# Altium schematic sheet MUX_EEM_EXT.SchDoc
size 420 x 297 mm; DocumentNumber: 7; SheetNumber: 7; SheetTotal: 8; EDA_Number: ARTIQ; ModifiedBy: -; Title2: -; DivGrp: ISE; ModifiedDate: -
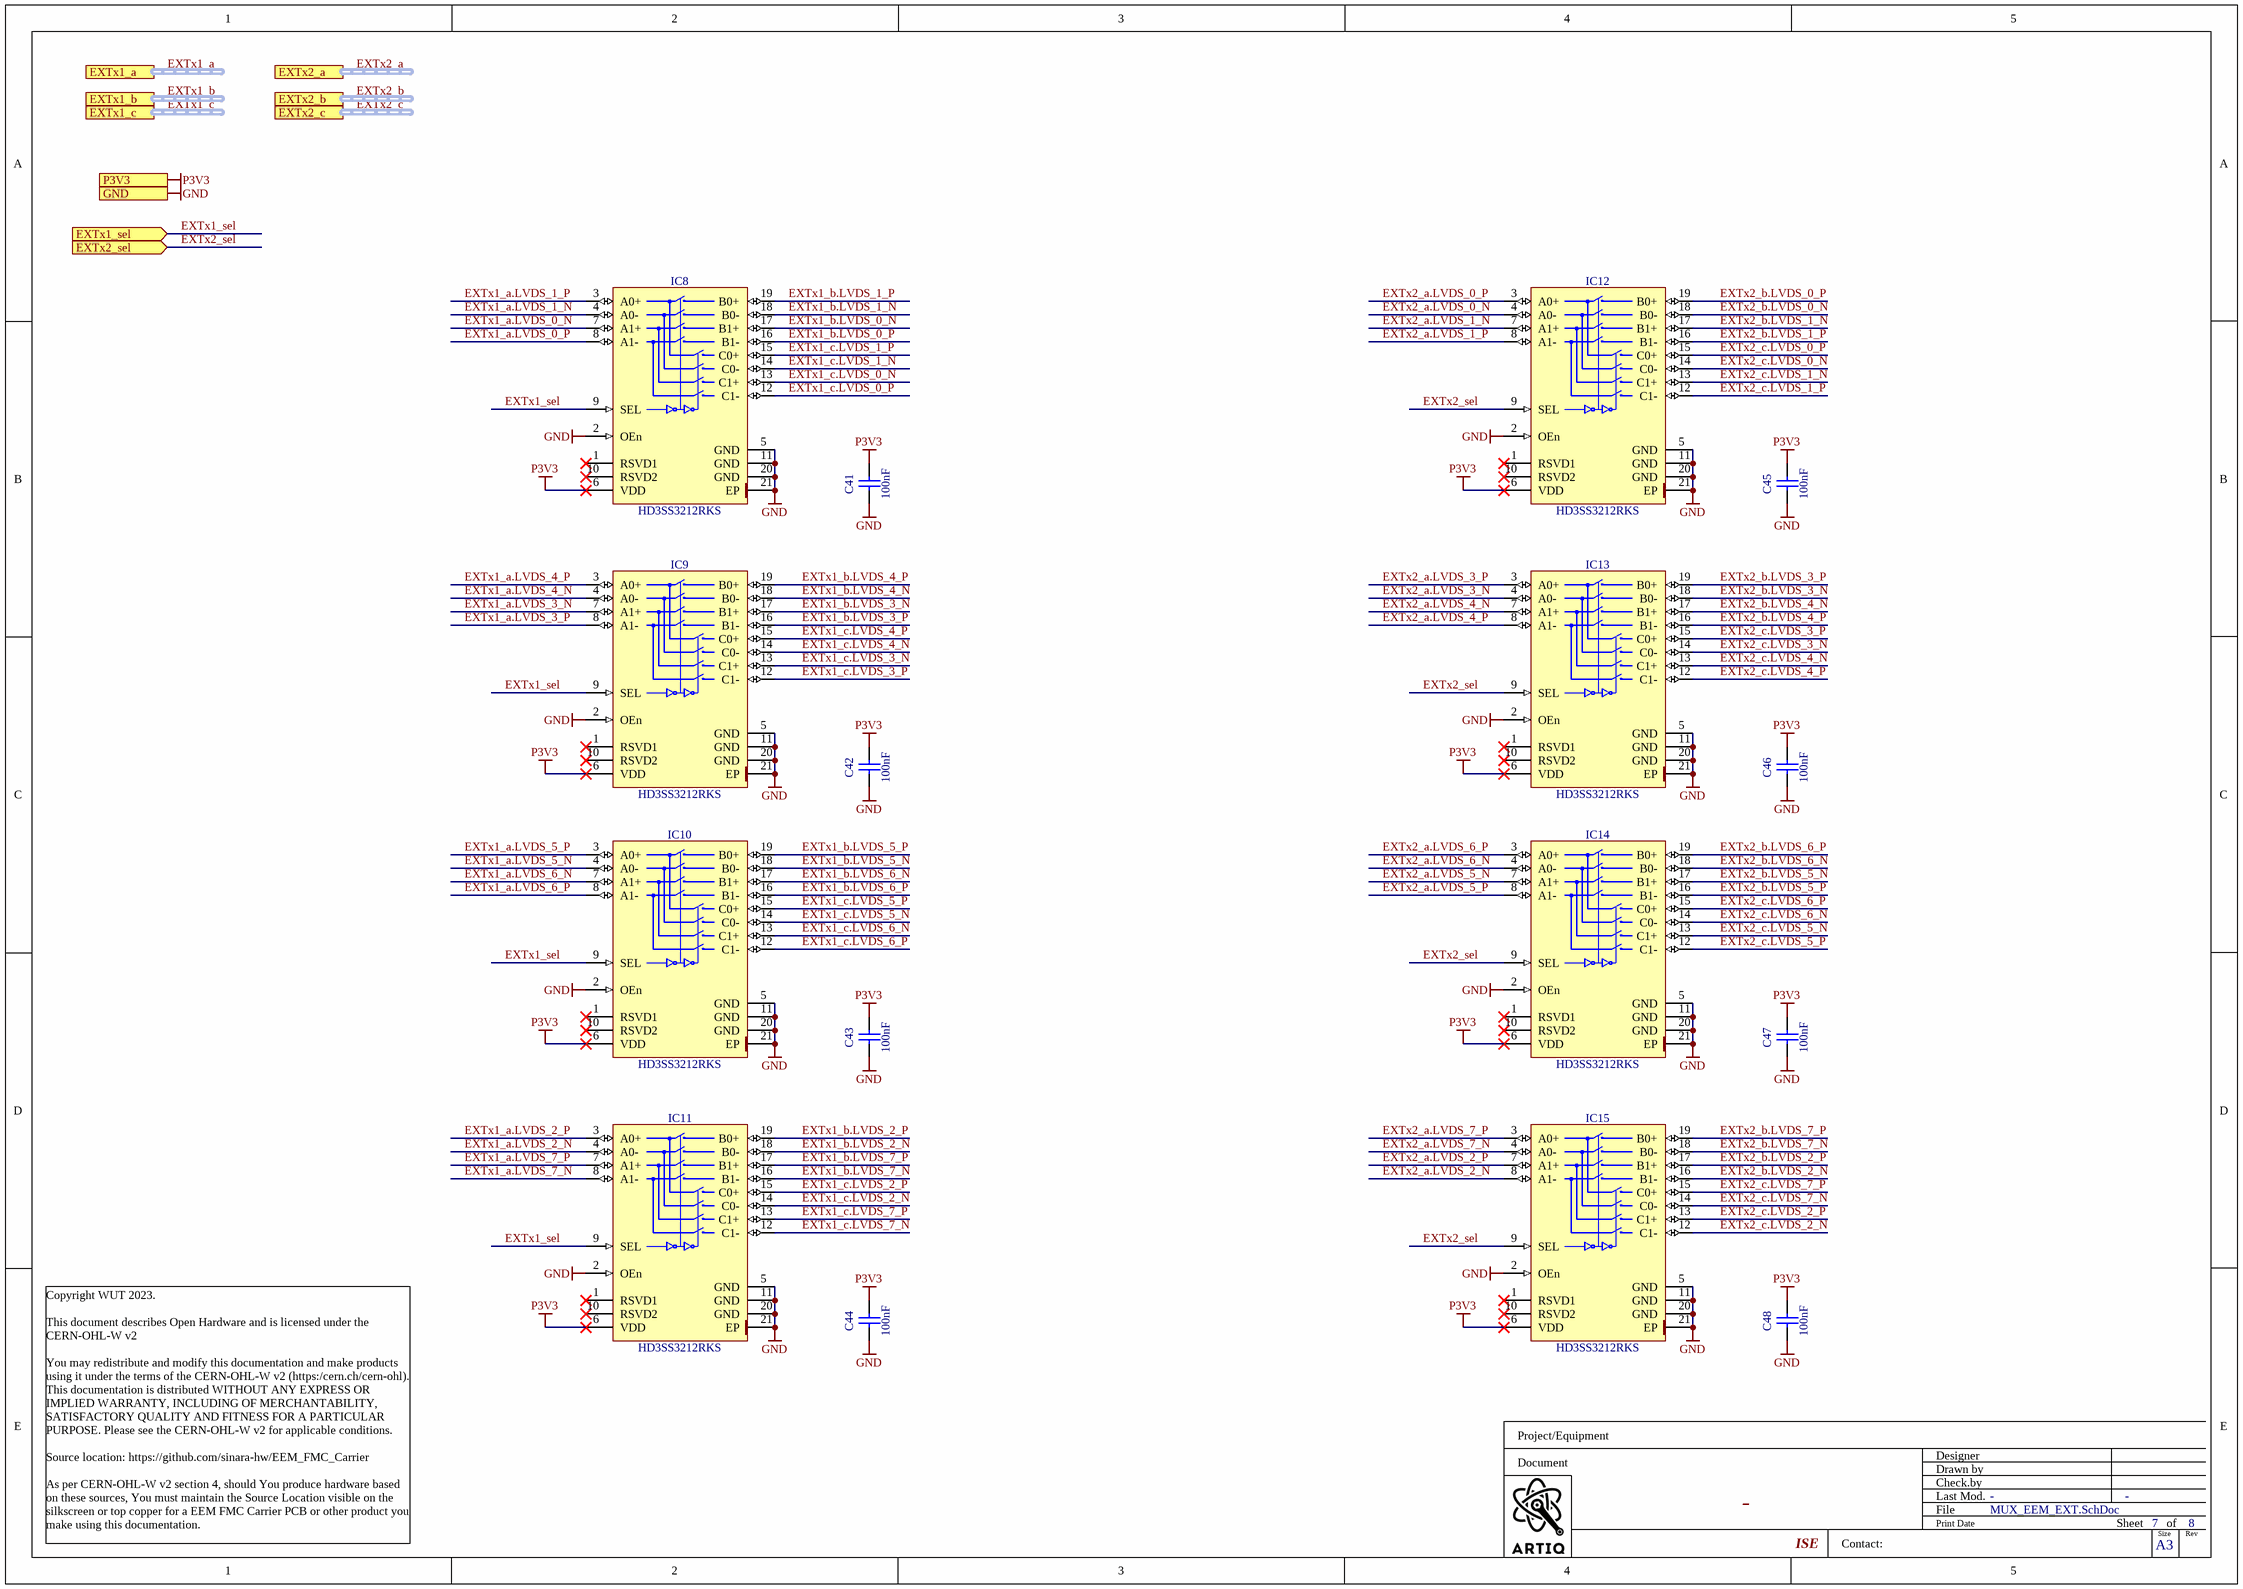
[diagram p0: MUX_EEM_EXT.SchDoc]

## Parts
C41  100nF  [CAPC1005X55N]
C42  100nF  [CAPC1005X55N]
C43  100nF  [CAPC1005X55N]
C44  100nF  [CAPC1005X55N]
C45  100nF  [CAPC1005X55N]
C46  100nF  [CAPC1005X55N]
C47  100nF  [CAPC1005X55N]
C48  100nF  [CAPC1005X55N]
IC8  HD3SS3212RKS  [TEXAS_RKS0020A]
IC9  HD3SS3212RKS  [TEXAS_RKS0020A]
IC10  HD3SS3212RKS  [TEXAS_RKS0020A]
IC11  HD3SS3212RKS  [TEXAS_RKS0020A]
IC12  HD3SS3212RKS  [TEXAS_RKS0020A]
IC13  HD3SS3212RKS  [TEXAS_RKS0020A]
IC14  HD3SS3212RKS  [TEXAS_RKS0020A]
IC15  HD3SS3212RKS  [TEXAS_RKS0020A]

## Ports
EXTx1_a (harness ExtensionConnector), EXTx1_b (harness ExtensionConnector), EXTx1_c (harness ExtensionConnector), EXTx1_sel (in), EXTx2_a (harness ExtensionConnector), EXTx2_b (harness ExtensionConnector), EXTx2_c (harness ExtensionConnector), EXTx2_sel (in), GND, P3V3 (in)

## Nets
GND: C41.1 C42.1 C43.1 C44.1 C45.1 C46.1 C47.1 C48.1 IC8.2(OEn) IC8.5(GND) IC8.11(GND) IC8.20(GND) IC8.21(EP) IC9.2(OEn) IC9.5(GND) IC9.11(GND) IC9.20(GND) IC9.21(EP) IC10.2(OEn) IC10.5(GND) IC10.11(GND) IC10.20(GND) IC10.21(EP) IC11.2(OEn) IC11.5(GND) IC11.11(GND) IC11.20(GND) IC11.21(EP) IC12.2(OEn) IC12.5(GND) IC12.11(GND) IC12.20(GND) IC12.21(EP) IC13.2(OEn) IC13.5(GND) IC13.11(GND) IC13.20(GND) IC13.21(EP) IC14.2(OEn) IC14.5(GND) IC14.11(GND) IC14.20(GND) IC14.21(EP) IC15.2(OEn) IC15.5(GND) IC15.11(GND) IC15.20(GND) IC15.21(EP) ; port GND
P3V3: C41.2 C42.2 C43.2 C44.2 C45.2 C46.2 C47.2 C48.2 IC8.6(VDD) IC9.6(VDD) IC10.6(VDD) IC11.6(VDD) IC12.6(VDD) IC13.6(VDD) IC14.6(VDD) IC15.6(VDD) ; port P3V3
EXTx1_a.LVDS_0_N: IC8.7(A1+)
EXTx1_a.LVDS_0_P: IC8.8(A1-)
EXTx1_a.LVDS_1_N: IC8.4(A0-)
EXTx1_a.LVDS_1_P: IC8.3(A0+)
EXTx1_a.LVDS_2_N: IC11.4(A0-)
EXTx1_a.LVDS_2_P: IC11.3(A0+)
EXTx1_a.LVDS_3_N: IC9.7(A1+)
EXTx1_a.LVDS_3_P: IC9.8(A1-)
EXTx1_a.LVDS_4_N: IC9.4(A0-)
EXTx1_a.LVDS_4_P: IC9.3(A0+)
EXTx1_a.LVDS_5_N: IC10.4(A0-)
EXTx1_a.LVDS_5_P: IC10.3(A0+)
EXTx1_a.LVDS_6_N: IC10.7(A1+)
EXTx1_a.LVDS_6_P: IC10.8(A1-)
EXTx1_a.LVDS_7_N: IC11.8(A1-)
EXTx1_a.LVDS_7_P: IC11.7(A1+)
EXTx1_b.LVDS_0_N: IC8.17(B1+)
EXTx1_b.LVDS_0_P: IC8.16(B1-)
EXTx1_b.LVDS_1_N: IC8.18(B0-)
EXTx1_b.LVDS_1_P: IC8.19(B0+)
EXTx1_b.LVDS_2_N: IC11.18(B0-)
EXTx1_b.LVDS_2_P: IC11.19(B0+)
EXTx1_b.LVDS_3_N: IC9.17(B1+)
EXTx1_b.LVDS_3_P: IC9.16(B1-)
EXTx1_b.LVDS_4_N: IC9.18(B0-)
EXTx1_b.LVDS_4_P: IC9.19(B0+)
EXTx1_b.LVDS_5_N: IC10.18(B0-)
EXTx1_b.LVDS_5_P: IC10.19(B0+)
EXTx1_b.LVDS_6_N: IC10.17(B1+)
EXTx1_b.LVDS_6_P: IC10.16(B1-)
EXTx1_b.LVDS_7_N: IC11.16(B1-)
EXTx1_b.LVDS_7_P: IC11.17(B1+)
EXTx1_c.LVDS_0_N: IC8.13(C1+)
EXTx1_c.LVDS_0_P: IC8.12(C1-)
EXTx1_c.LVDS_1_N: IC8.14(C0-)
EXTx1_c.LVDS_1_P: IC8.15(C0+)
EXTx1_c.LVDS_2_N: IC11.14(C0-)
EXTx1_c.LVDS_2_P: IC11.15(C0+)
EXTx1_c.LVDS_3_N: IC9.13(C1+)
EXTx1_c.LVDS_3_P: IC9.12(C1-)
EXTx1_c.LVDS_4_N: IC9.14(C0-)
EXTx1_c.LVDS_4_P: IC9.15(C0+)
EXTx1_c.LVDS_5_N: IC10.14(C0-)
EXTx1_c.LVDS_5_P: IC10.15(C0+)
EXTx1_c.LVDS_6_N: IC10.13(C1+)
EXTx1_c.LVDS_6_P: IC10.12(C1-)
EXTx1_c.LVDS_7_N: IC11.12(C1-)
EXTx1_c.LVDS_7_P: IC11.13(C1+)
EXTx1_sel: IC8.9(SEL) IC9.9(SEL) IC10.9(SEL) IC11.9(SEL) ; port EXTx1_sel
EXTx2_a.LVDS_0_N: IC12.4(A0-)
EXTx2_a.LVDS_0_P: IC12.3(A0+)
EXTx2_a.LVDS_1_N: IC12.7(A1+)
EXTx2_a.LVDS_1_P: IC12.8(A1-)
EXTx2_a.LVDS_2_N: IC15.8(A1-)
EXTx2_a.LVDS_2_P: IC15.7(A1+)
EXTx2_a.LVDS_3_N: IC13.4(A0-)
EXTx2_a.LVDS_3_P: IC13.3(A0+)
EXTx2_a.LVDS_4_N: IC13.7(A1+)
EXTx2_a.LVDS_4_P: IC13.8(A1-)
EXTx2_a.LVDS_5_N: IC14.7(A1+)
EXTx2_a.LVDS_5_P: IC14.8(A1-)
EXTx2_a.LVDS_6_N: IC14.4(A0-)
EXTx2_a.LVDS_6_P: IC14.3(A0+)
EXTx2_a.LVDS_7_N: IC15.4(A0-)
EXTx2_a.LVDS_7_P: IC15.3(A0+)
EXTx2_b.LVDS_0_N: IC12.18(B0-)
EXTx2_b.LVDS_0_P: IC12.19(B0+)
EXTx2_b.LVDS_1_N: IC12.17(B1+)
EXTx2_b.LVDS_1_P: IC12.16(B1-)
EXTx2_b.LVDS_2_N: IC15.16(B1-)
EXTx2_b.LVDS_2_P: IC15.17(B1+)
EXTx2_b.LVDS_3_N: IC13.18(B0-)
EXTx2_b.LVDS_3_P: IC13.19(B0+)
EXTx2_b.LVDS_4_N: IC13.17(B1+)
EXTx2_b.LVDS_4_P: IC13.16(B1-)
EXTx2_b.LVDS_5_N: IC14.17(B1+)
EXTx2_b.LVDS_5_P: IC14.16(B1-)
EXTx2_b.LVDS_6_N: IC14.18(B0-)
EXTx2_b.LVDS_6_P: IC14.19(B0+)
EXTx2_b.LVDS_7_N: IC15.18(B0-)
EXTx2_b.LVDS_7_P: IC15.19(B0+)
EXTx2_c.LVDS_0_N: IC12.14(C0-)
EXTx2_c.LVDS_0_P: IC12.15(C0+)
EXTx2_c.LVDS_1_N: IC12.13(C1+)
EXTx2_c.LVDS_1_P: IC12.12(C1-)
EXTx2_c.LVDS_2_N: IC15.12(C1-)
EXTx2_c.LVDS_2_P: IC15.13(C1+)
EXTx2_c.LVDS_3_N: IC13.14(C0-)
EXTx2_c.LVDS_3_P: IC13.15(C0+)
EXTx2_c.LVDS_4_N: IC13.13(C1+)
EXTx2_c.LVDS_4_P: IC13.12(C1-)
EXTx2_c.LVDS_5_N: IC14.13(C1+)
EXTx2_c.LVDS_5_P: IC14.12(C1-)
EXTx2_c.LVDS_6_N: IC14.14(C0-)
EXTx2_c.LVDS_6_P: IC14.15(C0+)
EXTx2_c.LVDS_7_N: IC15.14(C0-)
EXTx2_c.LVDS_7_P: IC15.15(C0+)
EXTx2_sel: IC12.9(SEL) IC13.9(SEL) IC14.9(SEL) IC15.9(SEL) ; port EXTx2_sel

Not connected (* = marked no-connect by the designer): IC8 1(RSVD1)* 10(RSVD2)*; IC9 1(RSVD1)* 10(RSVD2)*; IC10 1(RSVD1)* 10(RSVD2)*; IC11 1(RSVD1)* 10(RSVD2)*; IC12 1(RSVD1)* 10(RSVD2)*; IC13 1(RSVD1)* 10(RSVD2)*; IC14 1(RSVD1)* 10(RSVD2)*; IC15 1(RSVD1)* 10(RSVD2)*

## Buses and harness runs
harness EXTx1_a = port EXTx1_a
harness EXTx1_b = port EXTx1_b
harness EXTx1_c = port EXTx1_c
harness EXTx2_a = port EXTx2_a
harness EXTx2_b = port EXTx2_b
harness EXTx2_c = port EXTx2_c

## Notes on the sheet
- Project/Equipment
- Document
- Designer
- Drawn by
- Check.by
- Copyright WUT 2023.
  This document describes Open Hardware and is licensed under the CERN-OHL-W v2
  You may redistribute and modify this documentation and make products using it under the terms of the CERN-OHL-W v2 (https:/cern.ch/cern-ohl). This documentation is distributed WITHOUT ANY EXPRESS OR IMPLIED WARRANTY, INCLUDING OF MERCHANTABILITY, SATISFACTORY QUALITY AND FITNESS FOR A PARTICULAR PURPOSE. Please see the CERN-OHL-W v2 for applicable conditions.
  Source location: https://github.com/sinara-hw/EEM_FMC_Carrier
  As per CERN-OHL-W v2 section 4, should You produce hardware based on these sources, You must maintain the Source Location visible on the silkscreen or top copper for a EEM FMC Carrier PCB or other product you make using this documentation.
- Contact:
- File
- Last Mod.
- Print Date
- Sheet
- Size
- A3
- of
- Rev

## Library data of the parts
C41-C48 = CC0402_100NF_16V_10%_X7R: Non-polarised capacitor; Part Description: SMD Multilayer Chip Ceramic Capacitor; Manufacturer: GENERIC; Manufacturer1 Part Number: GRM155R71C104KA88D; Voltage: 16V; TC: X7R; Tolerance: ±10%; Part Number: CC0402_100NF_16V_10%_X7R; Component Kind: Standard; Component Type: Standard; Pin Count: 2; Value: 100nF; Status: Not Recommended; Manufacturer Part Number: CC0402_100NF_16V_10%_X7R; Case: 0402; Mounted: Yes; Socket: No; SMD: Yes; Sense: No; HelpURL: \\cern.ch\dfs\Applications\Altium\Datasheets\CC0402_X7R_MURATA_GRM.pdf; Author: CERN DEM JLC; CreateDate: 05.12.2013; LatestRevisionDate: 03.12.2007; Manufacturer1 Example: MURATA; Manufacturer1 ComponentHeight: 0.55mm
IC8-IC15 = HD3SS3212RKS: Two-Channel Differential 2:1/1:2 USB3.1 Mux/Demux; Manufacturer: TEXAS INSTRUMENTS; PressFit: No; Bonding: No; Part Number: HD3SS3212RKS; Component Kind: Standard; Component Type: Standard; Device: HD3SS3212RKS; PackageDescription: QFN, TEXAS Case Style RKS, 0.50mm Pitch, Rect.; 20 Pin, 2.50mm L X 4.50mm W X 1.00mm H body (w/Thermal Tab 1.1mm X 3.1mm); Part Description: Two-Channel Differential 2:1/1:2 USB3.1 Mux/Demux; Manufacturer Part Number: HD3SS3212RKS; Pin Count: 21; Case: TQFN20; Mounted: Yes; Socket: No; SMD: Yes; Sense: No; ComponentHeight: 1mm; Author: CERN DEM BC; HelpURL: \\cern.ch\dfs\Applications\Altium\Datasheets\HD3SS3212RKS.pdf; CreateDate: 2019-11-06; LatestRevisionDate: 2019-11-06